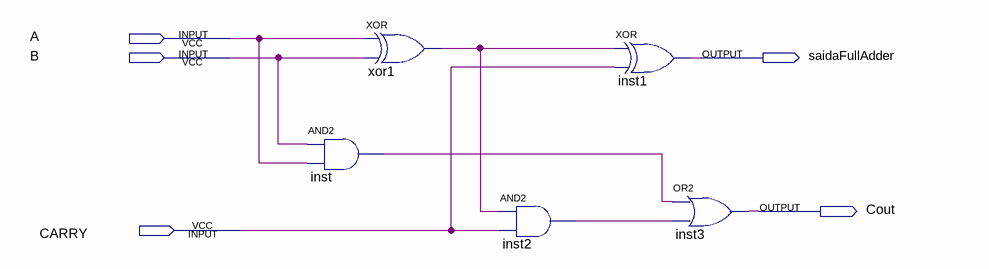
[diagram p0: schematic sheet]
// Quartus schematic SomadorInit.bdf as structural Verilog: 5 symbols, 5 pins
module SomadorInit (
  input  A,
  input  B,
  input  CARRY,
  output saidaFullAdder,
  output Cout
);

  wire inst2_out, inst_out, xor1_out;

  and inst (inst_out, B, A);
  xor xor1 (xor1_out, A, B);
  and inst2 (inst2_out, xor1_out, CARRY);
  xor inst1 (saidaFullAdder, xor1_out, CARRY);
  or inst3 (Cout, inst_out, inst2_out);
endmodule
